# Altium schematic sheet K60_main.SchDoc
size A4
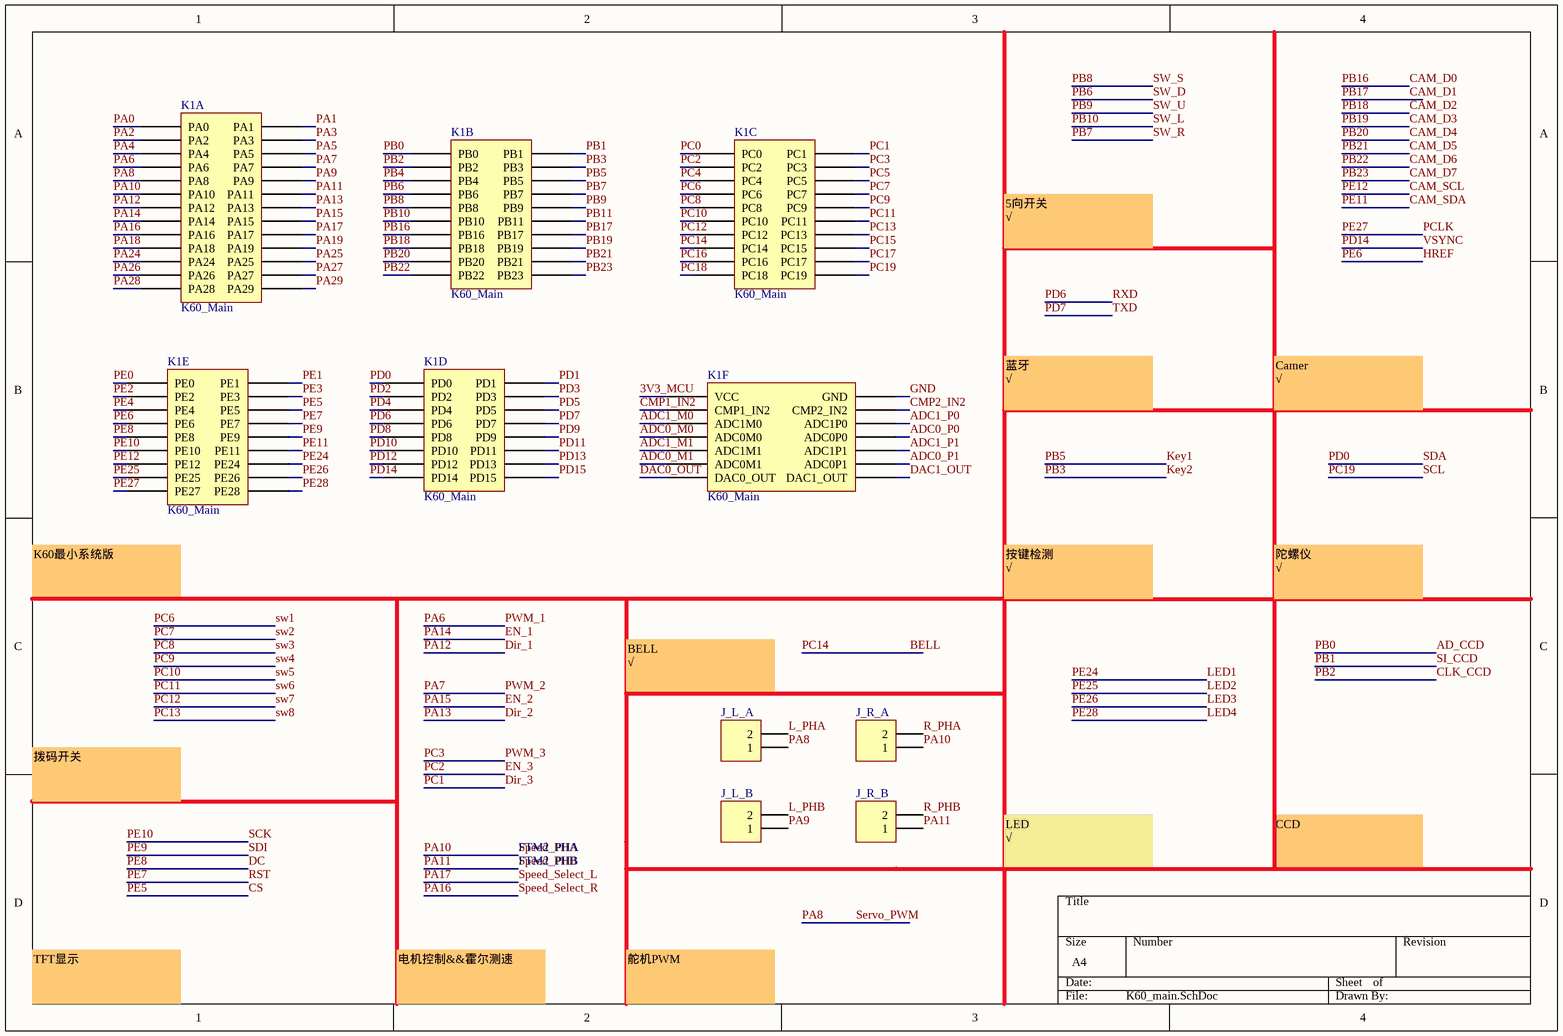
[diagram p0: K60_main.SchDoc]

## Parts
J_L_A  Header 2  [HDR1X2]  (value not drawn)
J_L_B  Header 2  [HDR1X2]  (value not drawn)
J_R_A  Header 2  [HDR1X2]  (value not drawn)
J_R_B  Header 2  [HDR1X2]  (value not drawn)
K1  K60_Main  [K60_Main_Board]  (parts A,B,C,D,E,F of 6)

## Nets
3V3_MCU: K1.11(VCC)
AD_CCD: K1.49(PB0)  [also labelled PB0]
ADC0_M0: K1.23(ADC0M0)
ADC0_M1: K1.27(ADC0M1)
ADC0_P0: K1.24(ADC0P0)
ADC0_P1: K1.28(ADC0P1)
ADC1_M0: K1.21(ADC1M0)
ADC1_M1: K1.25(ADC1M1)
ADC1_P0: K1.22(ADC1P0)
ADC1_P1: K1.26(ADC1P1)
BELL: K1.35(PC14)  [also labelled PC14]
CAM_D0: K1.327(PB16)  [also labelled PB16]
CAM_D1: K1.326(PB17)  [also labelled PB17]
CAM_D2: K1.325(PB18)  [also labelled PB18]
CAM_D3: K1.324(PB19)  [also labelled PB19]
CAM_D4: K1.323(PB20)  [also labelled PB20]
CAM_D5: K1.322(PB21)  [also labelled PB21]
CAM_D6: K1.321(PB22)  [also labelled PB22]
CAM_D7: K1.320(PB23)  [also labelled PB23]
CAM_SCL: K1.29(PE12)  [also labelled PE12]
CAM_SDA: K1.210(PE11)  [also labelled PE11]
CLK_CCD: K1.47(PB2)  [also labelled PB2]
CMP1_IN2: K1.13(CMP1_IN2)
CMP2_IN2: K1.14(CMP2_IN2)
CS: K1.216(PE5)  [also labelled PE5]
DAC0_OUT: K1.54(DAC0_OUT)
DAC1_OUT: K1.53(DAC1_OUT)
DC: K1.213(PE8)  [also labelled PE8]
Dir_1: K1.423(PA12)  [also labelled PA12]
Dir_2: K1.422(PA13)  [also labelled PA13]
Dir_3: K1.318(PC1)  [also labelled PC1]
EN_1: K1.421(PA14)  [also labelled PA14]
EN_2: K1.420(PA15)  [also labelled PA15]
EN_3: K1.317(PC2)  [also labelled PC2]
GND: K1.12(GND)
HREF: K1.215(PE6)  [also labelled PE6]
Key1: K1.44(PB5)  [also labelled PB5]
Key2: K1.46(PB3)  [also labelled PB3]
L_PHA: J_L_A.2
L_PHB: J_L_B.2
LED1: K1.52(PE24)  [also labelled PE24]
LED2: K1.51(PE25)  [also labelled PE25]
LED3: K1.438(PE26)  [also labelled PE26]
LED4: K1.436(PE28)  [also labelled PE28]
PA0: K1.435(PA0)
PA1: K1.434(PA1)
PA2: K1.433(PA2)
PA3: K1.432(PA3)
PA4: K1.431(PA4)
PA5: K1.430(PA5)
PA6: K1.429(PA6)  [also labelled PWM_1]
PA7: K1.428(PA7)  [also labelled PWM_2]
PA8: J_L_A.1 K1.427(PA8)  [also labelled Servo_PWM]
PA9: J_L_B.1 K1.426(PA9)
PA10: J_R_A.1 K1.425(PA10)  [also labelled Speed_PHA]
PA11: J_R_B.1 K1.424(PA11)  [also labelled Speed_PHB]
PA16: K1.419(PA16)  [also labelled Speed_Select_R]
PA17: K1.418(PA17)  [also labelled Speed_Select_L]
PA18: K1.417(PA18)
PA19: K1.416(PA19)
PA24: K1.415(PA24)
PA25: K1.414(PA25)
PA26: K1.413(PA26)
PA27: K1.412(PA27)
PA28: K1.411(PA28)
PA29: K1.410(PA29)
PB1: K1.48(PB1)  [also labelled SI_CCD]
PB4: K1.45(PB4)
PB6: K1.43(PB6)  [also labelled SW_D]
PB7: K1.42(PB7)  [also labelled SW_R]
PB8: K1.41(PB8)  [also labelled SW_S]
PB9: K1.330(PB9)  [also labelled SW_U]
PB10: K1.329(PB10)  [also labelled SW_L]
PB11: K1.328(PB11)
PC0: K1.319(PC0)
PC3: K1.316(PC3)  [also labelled PWM_3]
PC4: K1.315(PC4)
PC5: K1.314(PC5)
PC6: K1.313(PC6)  [also labelled sw1]
PC7: K1.312(PC7)  [also labelled sw2]
PC8: K1.311(PC8)  [also labelled sw3]
PC9: K1.310(PC9)  [also labelled sw4]
PC10: K1.39(PC10)  [also labelled sw5]
PC11: K1.38(PC11)  [also labelled sw6]
PC12: K1.37(PC12)  [also labelled sw7]
PC13: K1.36(PC13)  [also labelled sw8]
PC15: K1.34(PC15)
PC16: K1.33(PC16)
PC17: K1.32(PC17)
PC18: K1.31(PC18)
PC19: K1.238(PC19)  [also labelled SCL]
PCLK: K1.437(PE27)  [also labelled PE27]
PD0: K1.237(PD0)  [also labelled SDA]
PD1: K1.236(PD1)
PD2: K1.235(PD2)
PD3: K1.234(PD3)
PD4: K1.233(PD4)
PD5: K1.232(PD5)
PD6: K1.231(PD6)  [also labelled RXD]
PD7: K1.230(PD7)  [also labelled TXD]
PD8: K1.229(PD8)
PD9: K1.228(PD9)
PD10: K1.227(PD10)
PD11: K1.226(PD11)
PD12: K1.225(PD12)
PD13: K1.224(PD13)
PD14: K1.223(PD14)  [also labelled VSYNC]
PD15: K1.222(PD15)
PE0: K1.221(PE0)
PE1: K1.220(PE1)
PE2: K1.219(PE2)
PE3: K1.218(PE3)
PE4: K1.217(PE4)
PE7: K1.214(PE7)  [also labelled RST]
PE9: K1.212(PE9)  [also labelled SDI]
PE10: K1.211(PE10)  [also labelled SCK]
R_PHA: J_R_A.2
R_PHB: J_R_B.2

## Notes on the sheet
- 5向开关
  √
- 蓝牙
  √
- Camer
  √
- K60最小系统版
- 按键检测
  √
- 陀螺仪
  √
- (near J_L_A) BELL
  √
- 拨码开关
- FTM2_PHA
- FTM2_PHB
- LED
  √
- CCD
- TFT显示
- 电机控制&&霍尔测速
- 舵机PWM

## Library data of the parts
J_L_A J_L_B J_R_A J_R_B = Header 2: Header, 2-Pin; LatestRevisionDate: 17-Jul-2002; LatestRevisionNote: Re-released for DXP Platform.; Publisher: Altium Limited